# EAGLE design stm32teensy (EAGLE 9.6.2)
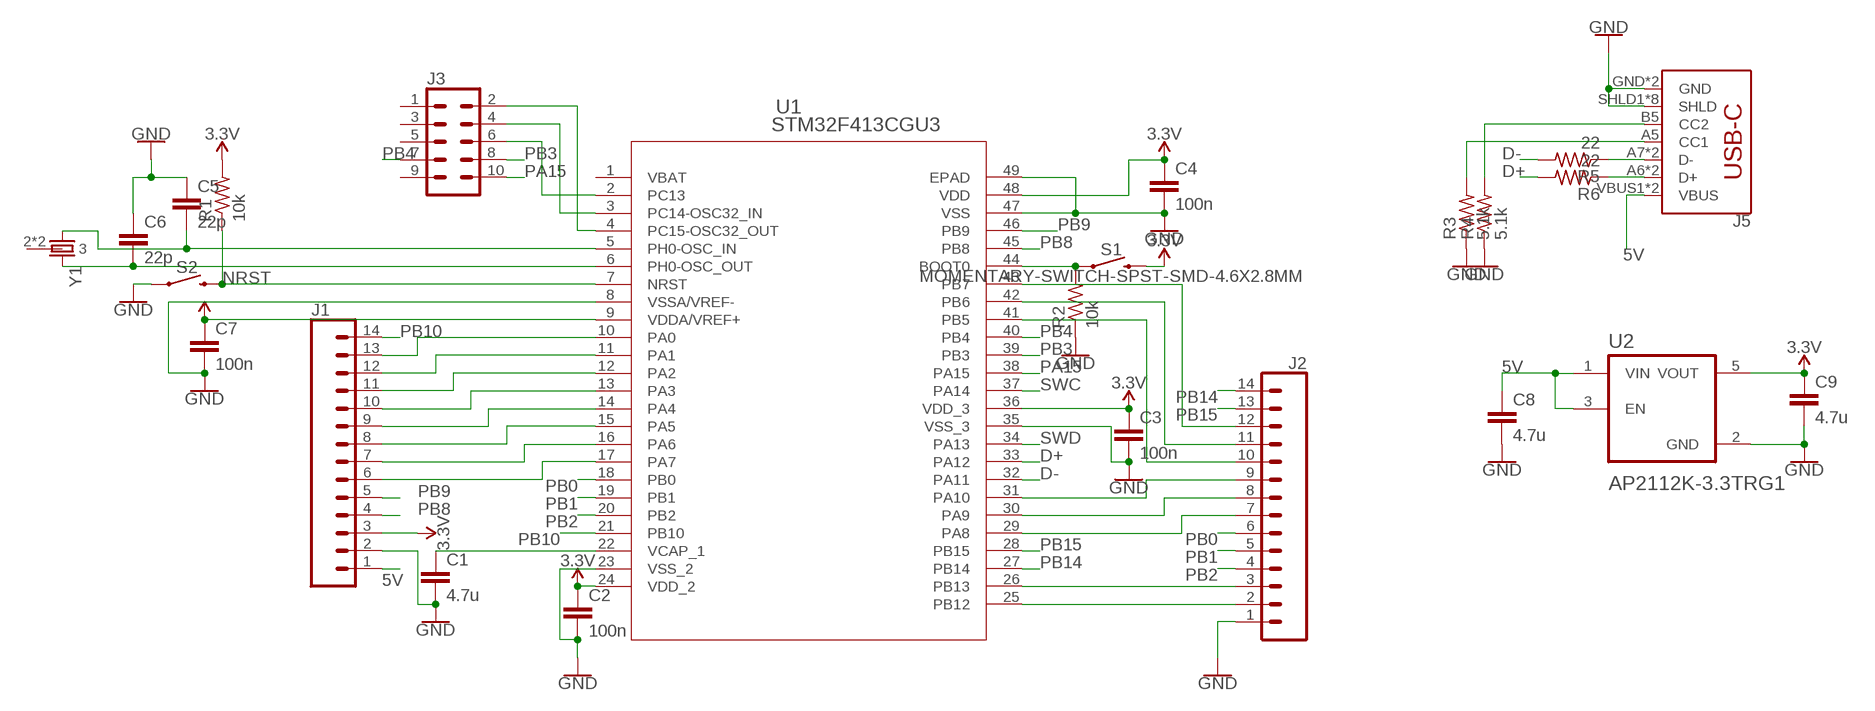
[diagram p0: schematic, sheet 1]

## Parts
C1  4.7u  C0402  [0402-C]
C2  100n  C0402  [0402-C]
C3  100n  C0402  [0402-C]
C4  100n  C0402  [0402-C]
C5  22p  C0402  [0402-C]
C6  22p  C0402  [0402-C]
C7  100n  C0402  [0402-C]
C8  4.7u  C0402  [0402-C]
C9  4.7u  C0402  [0402-C]
J1  CONN_14  [1X14]
J2  CONN_14  [1X14]
J3  CONN_05X2SHD_SMD  [2X5-SHROUDED_SMD]
J5  SPARKFUN-CONNECTORS_USB_C16PIN  [SPARKFUN-CONNECTORS_USB-C-16P]
R1  10k  R0402  [0402-R]
R2  10k  R0402  [0402-R]
R3  5.1k  R0402  [0402-R]
R4  5.1k  R0402  [0402-R]
R5  22  R0402  [0402-R]
R6  22  R0402  [0402-R]
S1  MOMENTARY-SWITCH-SPST-SMD-4.6X2.8MM  [TACTILE_SWITCH_SMD_4.6X2.8MM]
S2  MOMENTARY-SWITCH-SPST-SMD-4.6X2.8MM  [TACTILE_SWITCH_SMD_4.6X2.8MM]
U1  STM32F413CGU3  [UFQFPN_13CGU3_STM]
U2  AP2112K-3.3TRG1  [SOT95P285X140-5N]
Y1  CRYSTAL-3.2X2.54-PIN  [XTAL-3.2X2.5]

## Nets
3.3V: C2.1 C3.1 C4.1 C7.1 C9.1 J1.3 R1.2 S1.3 S1.4 U1.9(VDDA/VREF+) U1.24(VDD_2) U1.36(VDD_3) U1.48(VDD) U2.5(VOUT)
5V: C8.1 J1.1 J5.VBUS1(VBUS) J5.VBUS2(VBUS) U2.1(VIN) U2.3(EN)
D+: R6.2 U1.33(PA12)
D-: R5.2 U1.32(PA11)
GND: C1.2 C2.2 C3.2 C4.2 C5.1 C6.1 C7.2 C8.2 C9.2 J1.2 J2.1 J5.GND J5.GND2(GND) J5.SHLD1(SHLD) J5.SHLD2(SHLD) J5.SHLD3(SHLD) J5.SHLD4(SHLD) J5.SHLD5(SHLD) J5.SHLD6(SHLD) J5.SHLD7(SHLD) J5.SHLD8(SHLD) R2.1 R3.1 R4.1 S2.1 S2.2 U1.8(VSSA/VREF-) U1.23(VSS_2) U1.35(VSS_3) U1.47(VSS) U1.49(EPAD) U2.2(GND)
N$1: J3.6 U1.2(PC13)
N$2: R2.2 S1.1 S1.2 U1.44(BOOT0)
N$3: C6.2 U1.6(PH0-OSC_OUT) Y1.3
N$4: C5.2 U1.5(PH0-OSC_IN) Y1.1
N$5: J1.13 U1.10(PA0)
N$6: J2.10 U1.41(PB5)
N$7: C1.1 U1.22(VCAP_1)
N$8: J1.12 U1.11(PA1)
N$9: J1.11 U1.12(PA2)
N$10: J1.10 U1.13(PA3)
N$11: J1.9 U1.14(PA4)
N$12: J1.8 U1.15(PA5)
N$13: J1.7 U1.16(PA6)
N$14: J1.6 U1.17(PA7)
N$15: J2.2 U1.25(PB12)
N$16: J2.3 U1.26(PB13)
N$17: J2.11 U1.42(PB6)
N$18: J2.12 U1.43(PB7)
N$19: J2.7 U1.29(PA8)
N$20: J2.8 U1.30(PA9)
N$21: J2.9 U1.31(PA10)
N$22: J3.4 U1.3(PC14-OSC32_IN)
N$23: J3.2 U1.4(PC15-OSC32_OUT)
N$24: J5.A7(D-) J5.B7(D-) R5.1
N$25: J5.A6(D+) J5.B6(D+) R6.1
N$27: J5.A5(CC1) R3.2
N$28: J5.B5(CC2) R4.2
NRST: R1.1 S2.3 S2.4 U1.7(NRST)
PA15: J3.10 U1.38(PA15)
PB0: J2.6 U1.18(PB0)
PB1: J2.5 U1.19(PB1)
PB2: J2.4 U1.20(PB2)
PB3: J3.8 U1.39(PB3)
PB4: J3.7 U1.40(PB4)
PB8: J1.4 U1.45(PB8)
PB9: J1.5 U1.46(PB9)
PB10: J1.14 U1.21(PB10)
PB14: J2.14 U1.27(PB14)
PB15: J2.13 U1.28(PB15)
SWC: U1.37(PA14)
SWD: U1.34(PA13)
Unconnected: J3.1 J3.3 J3.5 J3.9 U1.1(VBAT) Y1.2 Y1.4

## Library data of the parts
C1-C9 = comma.ai:C
J1 J2 = SparkFun-Connectors:CONN_14: Multi connection point. Often used as Generic Header-pin footprint for 0.1 inch spaced/style header connections On any of the 0.1 inch spaced packages, you can populate with these: Break Away Headers - Straight <https://www.sparkfun.com/products/116> (PRT-00116) Break Away Male Headers - Right Angle <https://www.sparkfun.com/products/553> (PRT-00553) Female Headers <https://www.sparkfun.com/products/115> (PRT-00115) Break Away Headers - Machine Pin <https://www.sparkfun.com/products/117> (PRT-00117) Break Away Female Headers - Swiss Machine Pin <https://www.sparkfun.com/products/743> (PRT-00743) For SCREWTERMINALS and SPRING TERMINALS visit here: Screw Terimnals on SparkFun.com <https://www.sparkfun.com/search/results?term=Screw+Terminals> (5mm/3.5mm/2.54mm spacing) This device is also useful as a general connection point to wire up your design to another part of your project. Our various solder wires solder well into these plated through hole pads. Hook-Up Wire - Assortment (Stranded, 22 AWG) <https://www.sparkfun.com/products/11375> (PRT-11375) Hook-Up Wire - Assortment (Solid Core, 22 AWG) <https://www.sparkfun.com/products/11367> (PRT-11367) View the entire wire category on our website here <https://www.sparkfun.com/categories/141> Special notes: Molex polarized connector foot print use with SKU : PRT-08231 with associated crimp pins and housings. 1MM SMD Version SKU: PRT-10208 NOTES ON THE VARIANTS LOCK and LOCK_LONGPADS... This footprint was designed to help hold the alignment of a through-hole component (i.e. 6-pin header) while soldering it into place. You may notice that each hole has been shifted either up or down by 0.005 of an inch from it's more standard position (which is a perfectly straight line). This slight alteration caused the pins (the squares in the middle) to touch the edges of the holes. Because they are alternating, it causes a "brace" to hold the component in place. 0.005 has proven to be the perfect amount of "off-center" position when using our standard breakaway headers. Although looks a little odd when you look at the bare footprint, once you have a header in there, the alteration is very hard to notice. Also,if you push a header all the way into place, it is covered up entirely on the bottom side.
J3 = SparkFun-Connectors:CONN_05X2: Multi connection point. Often used as Generic Header-pin footprint for 0.1 inch spaced/style header connections For AVR SPI programming port, see special device with nice symbol: "AVR_SPI_PROG_5x2.dev" You can populate with any combo of single row headers, but if you'd like an exact match, check these: 2x5 AVR ICSP Male Header <https://www.sparkfun.com/products/778> (PRT-00778) 2x5 Pin Shrouded Header <https://www.sparkfun.com/products/8506> (PRT-08506) On any of the 0.1 inch spaced packages, you can populate with these: Break Away Headers - Straight <https://www.sparkfun.com/products/116> (PRT-00116) Break Away Male Headers - Right Angle <https://www.sparkfun.com/products/553> (PRT-00553) Female Headers <https://www.sparkfun.com/products/115> (PRT-00115) Break Away Headers - Machine Pin <https://www.sparkfun.com/products/117> (PRT-00117) Break Away Female Headers - Swiss Machine Pin <https://www.sparkfun.com/products/743> (PRT-00743) Special note: the shrouded connector mates well with our 5x2 ribbon cables: 2x5 Pin IDC Ribbon Cable <https://www.sparkfun.com/products/8535> (PRT-08535); PROD_ID: CONN-09508
J5 = USB-C-Breakout:SPARKFUN-CONNECTORS_USB_C: USB Type C 16Pin Connector Super Speed pins not available on the 16-pin purely SMD connector so this part is best for USB 2.0 implementations. D1 and D2 are tied together enabling D+/- no matter which way the cable is plugged into the connector. The two channel configuration pins (CC1/2) are exposed. These are normally connected to ground via 5.1k resistors but can be reconfigured for high current/high power applications.; PROD_ID: CONN-14122
R1-R6 = comma.ai:R
S1 S2 = SparkFun-Switches:MOMENTARY-SWITCH-SPST: Momentary Switch (Pushbutton) - SPST Normally-open (NO) SPST momentary switches (buttons, pushbuttons). Variants PTH-12MM - 12mm square, through-hole Momentary Pushbutton Switch - 12mm Square <https://www.sparkfun.com/products/9190> (COM-09190) PTH-6.0MM, PTH-6.0MM-KIT - 6.0mm square, through-hole Mini Pushbutton Switch <https://www.sparkfun.com/products/97> (COM-00097) KIT package intended for soldering kit's - only one side of pads' copper is exposed. PTH-RIGHT-ANGLE-KIT - Right-angle, through-hole Right Angle Tactile Button <https://www.sparkfun.com/products/10791> - Used on SparkFun BigTime Watch Kit <https://www.sparkfun.com/products/11734> SMD-12MM - 12mm square, surface-mount Tactile Button - SMD (12mm) <https://www.sparkfun.com/products/12993> (COM-12993) Used on SparkFun PicoBoard <https://www.sparkfun.com/products/11888> SMD-4.5MM - 4.5mm Square Trackball Switch Used on SparkFun Blackberry Trackballer Breakout <https://www.sparkfun.com/products/13169> SMD-4.6MMX2.8MM - 4.60mm x 2.80mm, surface mount Used on SparkFun SAMD21 Mini Breakout <https://www.sparkfun.com/products/13664> SMD-5.2MM, SMD-5.2-REDUNDANT - 5.2mm square, surface-mount Mini Pushbutton Switch - SMD <https://www.sparkfun.com/products/8720> (COM-08720) Used on Arduino Pro Mini <https://www.sparkfun.com/products/11114> REDUNDANT package connects both switch circuits together SMD-6.0X3.5MM - 6.0 x 3.5mm, surface mount Momentary Reset Switch SMD <https://www.sparkfun.com/products/8229> (COM-08229) SMD-6.2MM-TALL - 6.2mm square, surface mount Tactile Button - SMD (6mm) <https://www.sparkfun.com/products/12992> Used on SparkFun Digital Sandbox <https://www.sparkfun.com/products/12651> SMD-RIGHT-ANGLE - Right-angle, surface mount Used on SparkFun Block for Intel® Edison - Arduino <https://www.sparkfun.com/products/13036>; PROD_ID: SWCH-13065
U1 = STMicroelectronics - STM32F303CCT6:STM32F413CGU3; BUILT_BY: EMA_Matt; COPYRIGHT: Copyright (C) 2018 Accelerated Designs. All rights reserved; DATASHEET: https://www.st.com/resource/en/datasheet/stm32f413cg.pdf; MANUFACTURER_PART_NUMBER: STM32F413CGU3; SOURCELIBRARY: Add_to_database_2020-11-25; VENDOR: STMicroelectronics
U2 = AP2112K-3.3TRG1:AP2112K-3.3TRG1: AP2112 Series 0.6 A 3.3 V Fixed Output SMT LDO Linear Regulator - SOT23-5 Check prices <https://pricing.snapeda.com/parts/AP2112K-3.3TRG1/Diodes%20Inc./view-part?ref=eda>; AVAILABILITY: Good; DESCRIPTION: Linear Voltage Regulator IC 1 Output 600mA SOT-25; MF: Diodes Inc.; MP: AP2112K-3.3TRG1; PACKAGE: SOT-753 Diodes Inc.; PRICE: None; PURCHASE-URL: https://pricing.snapeda.com/search/part/AP2112K-3.3TRG1/?ref=eda
Y1 = comma.ai:CRYSTAL-3.2X2.5

## Board
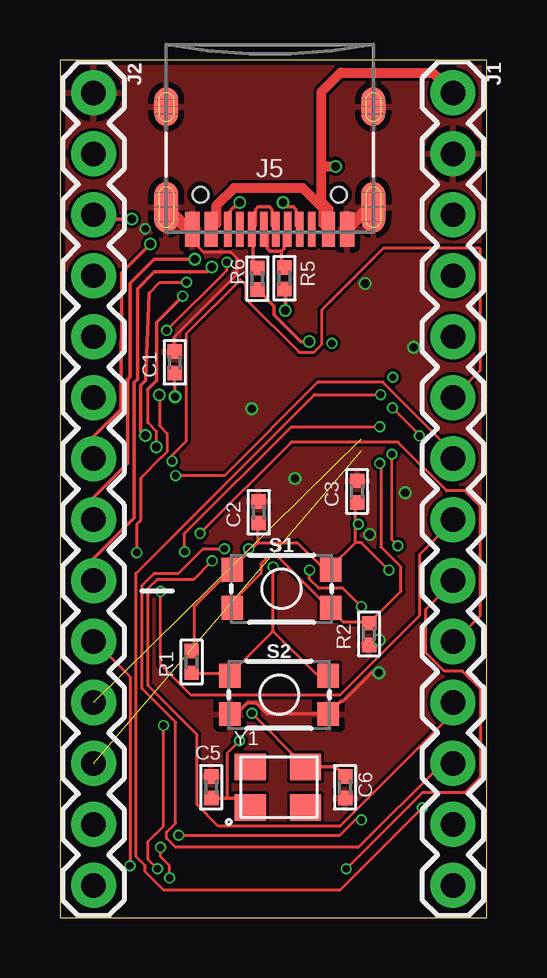
[diagram p1: board, top side]
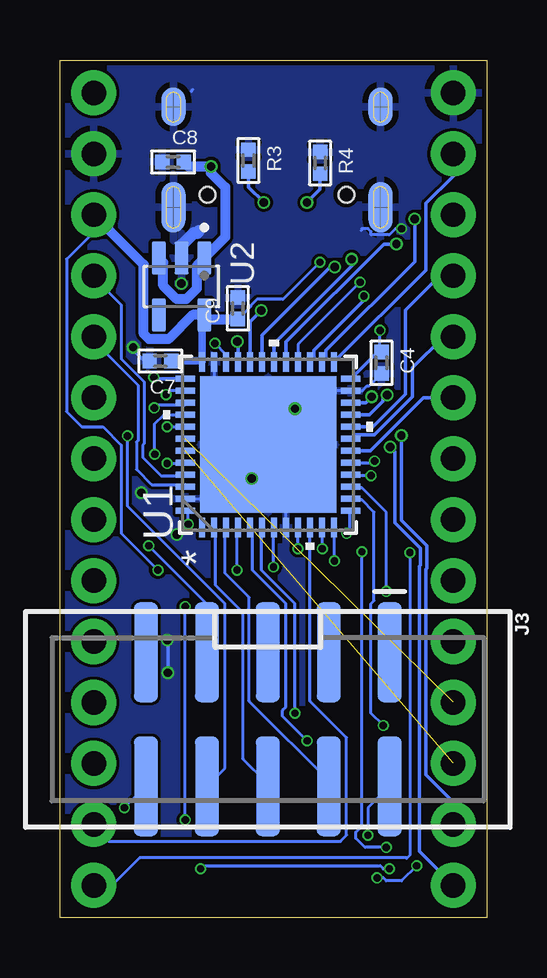
[diagram p2: board, bottom side, seen from below]

Size 17.8 x 35.73 mm. Coordinates in mm from the lower left corner, seen from the top.
Outline: 0,0 17.8,0 17.8,35.73 0,35.73 0,0
Copper layers (1*16): Top 0.035559375mm / dielectric 1.6mm / Bottom 0.035559375mm
Design rules "jlcpcb2layer": minimum track width 5mil, minimum drill 12mil, track to track 5mil, track to pad 5mil, pad to pad 5mil, via to via 5mil, smd to smd 5mil, copper to edge 8mil, drill to drill 6mil, minimum pad ring 5mil, minimum via ring 3mil, stop-mask expansion 2.5mil, vias tented up to drill 0mil, thermal gap 10mil

### Footprints (pad centres in the part's own frame; a part is rotated, then mirrored left to right if it is on the bottom)
0402-C = smd 0.6 x 0.6: 1 -0.45,0; 2 0.45,0
1X14 = drill 1.016 pad 1.88: 1 0,0; 2 2.54,0; 3 5.08,0; 4 7.62,0; 5 10.16,0; 6 12.7,0; 7 15.24,0; 8 17.78,0; 9 20.32,0; 10 22.86,0; 11 25.4,0; 12 27.94,0; 13 30.48,0; 14 33.02,0
2X5-SHROUDED_SMD = smd 4.15 x 1: 1 -2.794,5.08; 2 2.794,5.08; 3 -2.794,2.54; 4 2.794,2.54; 5 -2.794,0; 6 2.794,0; 7 -2.794,-2.54; 8 2.794,-2.54; 9 -2.794,-5.08; 10 2.794,-5.08
SPARKFUN-CONNECTORS_USB-C-16P = smd 0.3 x 1.45: A5 -1.25,0; A6 -0.25,0; A7 0.25,0; A8 1.25,0; B5 1.75,0; B6 0.75,0; B7 -0.75,0; B8 -1.75,0 | smd 0.6 x 1.45: GND -3.225,0; GND2 3.225,0 | smd 1 x 2.1: SHLD1 -4.32,-0.915; SHLD2 4.32,-0.915 | smd 1 x 2.1 bottom: SHLD3 -4.32,-0.915; SHLD4 4.32,-0.915 | smd 1 x 1.6: SHLD5 -4.32,-5.095; SHLD8 4.32,-5.095 | smd 1 x 1.6 bottom: SHLD6 -4.32,-5.095; SHLD7 4.32,-5.095 | smd 0.55 x 1.45: VBUS1 -2.45,0; VBUS2 2.45,0 | hole 0.65: -2.89,-1.445; 2.89,-1.445
0402-R = smd 0.6 x 0.6: 1 -0.45,0; 2 0.45,0
TACTILE_SWITCH_SMD_4.6X2.8MM = smd 0.9 x 1: 1 -2.05,-0.8; 2 2.05,-0.8; 3 2.05,0.8; 4 -2.05,0.8
UFQFPN_13CGU3_STM = smd 0.808 x 0.255: 1 -3.452,2.751; 2 -3.452,2.251; 3 -3.452,1.75; 4 -3.452,1.25; 5 -3.452,0.75; 6 -3.452,0.25; 7 -3.452,-0.25; 8 -3.452,-0.75; 9 -3.452,-1.25; 10 -3.452,-1.75; 11 -3.452,-2.251; 12 -3.452,-2.751; 25 3.452,-2.751; 26 3.452,-2.251; 27 3.452,-1.75; 28 3.452,-1.25; 29 3.452,-0.75; 30 3.452,-0.25; 31 3.452,0.25; 32 3.452,0.75; 33 3.452,1.25; 34 3.452,1.75; 35 3.452,2.251; 36 3.452,2.751 | smd 0.255 x 0.808: 13 -2.751,-3.452; 14 -2.251,-3.452; 15 -1.75,-3.452; 16 -1.25,-3.452; 17 -0.75,-3.452; 18 -0.25,-3.452; 19 0.25,-3.452; 20 0.75,-3.452; 21 1.25,-3.452; 22 1.75,-3.452; 23 2.251,-3.452; 24 2.751,-3.452; 37 2.751,3.452; 38 2.251,3.452; 39 1.75,3.452; 40 1.25,3.452; 41 0.75,3.452; 42 0.25,3.452; 43 -0.25,3.452; 44 -0.75,3.452; 45 -1.25,3.452; 46 -1.75,3.452; 47 -2.251,3.452; 48 -2.751,3.452 | smd 5.69 x 5.69: 49 0,0
SOT95P285X140-5N = smd 1.35 x 0.6: 1 -1.185,0.95; 2 -1.185,0; 3 -1.185,-0.95; 4 1.185,-0.95; 5 1.185,0.95
XTAL-3.2X2.5 = smd 1.3 x 1.1: 1 0,-1.8; 2 2.3,-1.8; 3 2.3,-0.1; 4 0,-0.1

### Placement (x,y rotation side)
C1  4.79,23.13 90 top
C2  8.29,16.89 90 top
C3  12.39,17.75 90 top
C4  4.39,23.11 270 bottom
C5  6.31,5.43 270 top
C6  11.89,5.43 90 top
C7  13.61,23.19 180 bottom
C8  13.08,31.48 180 bottom
C9  10.38,25.38 90 bottom
J1  16.39,34.36 270 top
J2  1.4,34.36 270 top
J3  9.13,8.26 270 bottom
J5  8.75,28.68 180 top
R1  5.49,10.65 90 top
R2  12.89,11.81 90 top
R3  9.94,31.54 270 bottom
R4  6.95,31.44 270 bottom
R5  9.36,26.64 270 top
R6  8.23,26.62 270 top
S1  9.24,13.7 0 top
S2  9.14,9.28 0 top
U1  9.12,19.7 90 bottom
U2  12.73,26.29 270 bottom
Y1  7.94,6.38 0 top

### Tracks (layer width: path | path; a pad name or v marks a point on that pad's centre or on a via)
3.3V  (via drill 0.3)
  Top 0.127: v4.45,24.46 6.96,26.97 v6.96,27.3 | 12.32,15.62 12.32,16.38 | 12.32,16.38 12.32,17.27 C3.1 | 12.32,15.62 11.3,14.61 S1.3 11.18,14.61 10.92,14.61 9.91,15.62 8.26,15.62 | 12.32,16.38 v12.45,16.38 | R1.2 5.59,11.18 5.59,12.95 7.11,14.48 S1.4 7.24,14.61 8,15.37 | 8.26,15.62 8.26,16.38 C2.1 | 8,15.37 8.26,15.62 | 8,15.37 v7.87,15.37 | 12.32,15.62 12.57,15.62 v13.72,14.48
  Bottom 0.127: C4.1 4.45,23.62 v4.45,24.46 | v6.96,27.3 8.51,25.75 9.59,25.75 9.85,25.49 9.85,25.46 C9.1 | v12.45,16.38 12.45,16.89 U1.48 | v7.87,15.37 7.87,16.13 U1.9 | v13.72,14.48 15.24,16 15.24,19.68 16,20.45 16.89,20.45 17.53,21.08 17.53,27.43 16.13,28.83 J1.3
  Bottom 0.15: U1.24 4.56,23.56 C4.1
  Bottom 0.305: U2.5 11.87,25.01 U1.36 11.91,23.19 C7.1
  Bottom 0.406: C9.1 11.61,24.93 U2.5 12.26,25.11 13.27,24.1 14.09,24.1 14.31,24.32 14.31,27.2 J1.3
5V  (via drill 0.35)
  Top 0.406: J5.VBUS2 6.52,28.9 6.52,29.65 7.25,30.39 10.13,30.39 10.98,29.54 10.98,28.9 J5.VBUS1 11.2,29.53 10.91,29.82 10.91,31.3 | 10.91,31.3 10.91,34.41 11.7,35.2 15.55,35.2 J1.1 | 10.91,31.3 v11.5,31.3
  Bottom 0.406: U2.3 13.49,27.29 13.49,26.33 12.93,25.77 12.53,25.77 12.1,26.2 12.1,27.16 U2.1 10.91,28.35 10.91,30.43 11.5,31.02 v11.5,31.3 12.45,31.3 C8.1
D+  (via drill 0.35)
  Top 0.15: R6.2 8.94,25.46 8.94,25.11 10.04,24 v10.4,24
  Bottom 0.15: U1.33 10.37,23.97 v10.4,24
D-  (via drill 0.35)
  Top 0.15: v9.4,25.3 9.4,26.15 R5.2
  Bottom 0.15: U1.32 9.87,24.83 v9.4,25.3
GND  (via drill 0.3, 0.35)
  Top 0.127: C1.2 4.79,24.21 7.38,26.8 7.38,27.47 7.13,27.72 5.99,27.72 5.53,28.19 J5.GND2
  Top 0.152: S2.1 7.36,8.48 7.82,8.94 8.18,8.94 8.64,8.48 S2.2 11.71,9 11.79,9 12.99,10.2 v13.3,10.2 | v13.32,11.57 13.11,11.36 R2.1
  Top 0.508: J5.GND2 5.34,28.68 J5.SHLD2 | J5.GND 12.89,29.59 J5.SHLD1
  Bottom 0.127: C4.2 4.9,22.15 4.99,22.15 5.19,21.95 U1.23 6.87,21.95 U1.49 | U1.35 11.37,21.95 9.16,19.74 | 9.16,19.74 U1.49 | U1.8 8.37,18.95 U1.49 | U1.47 11.45,17.45 9.16,19.74 | 12.32,34.42 12.27,34.5 | v3.56,28.7 3.81,28.7 4.06,28.45 4.83,28.45 4.83,28.57 4.95,28.7 5.21,28.7 5.23,28.62
  Bottom 0.152: v13.3,10.2 13.3,11.55 v13.32,11.57 | U1.49 8,20.82 v8,21.2 | v14.75,23.76 14.75,23.65 14.29,23.19 C7.2
  Bottom 0.508: 12,28.6 12.07,28.53 12.21,28.53 12.73,28.01 U2.2
  other vias: 9.8,18.3 12.73,26.41 14.4,17.7 12.92,15.96
  pour Top: 0,35.8 17.8,35.8 17.8,0 0,0
  pour Bottom: 0,35.7 17.8,35.7 17.8,0 0,0
N$1
  Bottom 0.127: U1.2 11.3,16.13 11.3,13.84 10.16,12.7 10.16,6.6 9.14,5.59 J3.6
N$2  (via drill 0.3)
  Top 0.127: v13.34,18.92 13.38,18.87 13.38,15.44 14.22,14.61 14.22,13.59 12.95,12.32 R2.2 12.83,12.32 11.81,12.32 11.3,12.83 S1.2 11.18,12.95 9.02,15.11 8.76,15.11 8.38,14.73 8.38,14.35 7.24,13.21 7.24,12.95 S1.1
  Bottom 0.127: v13.34,18.92 12.57,18.92 U1.44
N$3  (via drill 0.3)
  Top 0.127: v8,8.51 10.16,6.35 Y1.3
  Top 0.15: Y1.3 11.49,6.28 C6.2
  Bottom 0.127: v8,8.51 8,13.08 9.4,14.48 9.4,16.13 U1.6
N$4  (via drill 0.3)
  Top 0.127: v7.49,7.37 6.99,6.86 6.99,4.98
  Top 0.15: C5.2 6.99,4.98 7.54,4.98 Y1.1
  Bottom 0.127: v7.49,7.37 8.51,8.38 8.51,8.64 8.38,8.76 8.38,13.08 9.78,14.48 9.78,16.13 U1.5
N$5
  Bottom 0.127: U1.10 7.37,16.13 7.37,9.02 5.84,7.49 5.84,3.43 6.1,3.17 15.75,3.17 16.38,3.81 J1.13
N$6  (via drill 0.3)
  Top 0.127: v13.34,20.45 9.65,20.45 5.21,16 v5.21,15.24 | v4.19,2.92 4.19,2.54 4.57,2.16 v4.57,1.65 | v2.92,2.16 2.92,10.03 1.52,11.43 J2.10
  Bottom 0.127: v13.34,20.45 U1.41 | v5.21,15.24 5.21,3.81 5.46,3.56 5.46,3.3 5.08,2.92 v4.19,2.92 | v4.57,1.65 4.32,1.65 4.19,1.52 3.56,1.52 v2.92,2.16
N$7  (via drill 0.35)
  Top 0.127: v4.8,21.7 4.8,21.93 C1.1
  Bottom 0.15: U1.22 5.05,21.45 v4.8,21.7
N$8  (via drill 0.3)
  Top 0.127: v6.86,15.37 5.97,15.37 4.95,14.35 3.94,14.35 3.43,13.84 3.43,9.53 4.83,8.13 4.83,3.94 4.45,3.56 4.45,3.3 4.83,2.92 12.45,2.92 15.88,6.35 16.38,6.35 J1.12
  Bottom 0.127: v6.86,15.37 6.86,16.13 U1.11
N$9  (via drill 0.3)
  Top 0.127: v6.35,14.86 5.59,14.1 4.06,14.1 3.68,13.72 3.68,9.65 5.71,7.62 5.71,4.7 6.6,3.81 11.68,3.81 16.38,8.51 16.38,8.89 J1.11
  Bottom 0.127: v6.35,14.86 6.35,16.13 U1.12
N$10  (via drill 0.3)
  Top 0.127: v5.84,16 9.65,19.81 14.1,19.81 16.13,17.78 16.89,17.78 17.53,17.14 17.53,12.57 16.51,11.56 J1.10
  Bottom 0.127: v5.84,16 5.71,16.13 5.71,16.89 U1.13
N$11  (via drill 0.3)
  Top 0.127: v4.32,8 4.32,3.81 3.68,3.17 3.68,2.41 v4.06,2.03 | v11.94,2.03 15.11,5.21 16.89,5.21 17.53,5.84 17.53,9.53 16.76,10.29 16,10.29 15.24,11.05 15.24,12.83 16.38,13.97 J1.9
  Bottom 0.127: v4.32,8 4.83,8.51 4.83,13.08 4.7,13.21 4.7,16.89 5.21,17.4 5.59,17.4 U1.14 | v4.06,2.03 4.32,2.03 4.45,2.16 11.81,2.16 v11.94,2.03
N$12  (via drill 0.3)
  Top 0.127: v4.19,13.59 4.19,10.54 5.46,9.27 11.68,9.27 14.99,12.57 14.99,15.11 16.38,16.51 J1.8
  Bottom 0.127: v4.19,13.59 4.19,16.89 5.21,17.91 5.59,17.91 U1.15
N$13  (via drill 0.3)
  Top 0.127: v4.83,18.41 6.86,18.41 10.75,22.31 13.47,22.31 16.38,19.39 16.38,19.18 J1.7
  Bottom 0.127: v4.83,18.41 5.59,18.41 U1.16
N$14  (via drill 0.3)
  Top 0.127: v4.68,19.02 4.68,19.25 5.28,19.86 5.28,24.34 7.52,26.58 7.74,26.36 7.74,25.79 9.98,23.55 10.59,23.55 10.92,23.88 10.92,25.32 13.5,27.9 17.5,27.9 17.5,27.23 17.52,27.21 17.52,22.79 J1.6
  Bottom 0.127: U1.17 4.75,18.95 v4.68,19.02
N$15
  Bottom 0.15: U1.25 2.54,26.98 2.54,29.75 1.4,30.89 J2.2
N$16  (via drill 0.35)
  Top 0.15: v3.01,29.1 1.58,29.1 J2.3
  Bottom 0.15: U1.26 6.7,23.32 6.7,23.64 3.01,27.33 v3.01,29.1
N$17  (1 unrouted)
N$18  (1 unrouted)
N$19  (via drill 0.35)
  Top 0.15: v3.77,28.06 2.57,26.86 2.57,24.07 2.54,24.04 2.54,21.19 1.4,20.05 J2.7
  Bottom 0.15: U1.29 8.37,23.99 4.3,28.06 v3.77,28.06
N$20  (via drill 0.35)
  Top 0.15: v5.63,27.43 3.93,27.43 2.93,26.43 2.93,22.53 2.82,22.42 2.82,18.92 1.4,17.5 J2.8
  Bottom 0.15: U1.30 8.87,23.91 5.63,27.15 v5.63,27.43
N$21  (via drill 0.35)
  Top 0.15: v6.33,27.1 6.13,26.9 3.93,26.9 3.23,26.2 3.23,22.43 3.1,22.3 3.1,16.66 1.4,14.96 J2.9
  Bottom 0.15: U1.31 9.37,24.26 6.53,27.1 v6.33,27.1
N$22
  Bottom 0.127: U1.3 10.92,16.13 10.92,14.35 9.91,13.34 9.91,9.02 6.48,5.59 J3.4
N$23  (via drill 0.3)
  Top 0.127: v10.41,14.48 10.41,14.1 10.79,13.72 11.81,13.72 v12.57,12.95 | v12.57,4.06 12.32,4.06 11.68,3.43 v4.95,3.43
  Bottom 0.127: v10.41,14.48 10.41,16.13 U1.4 | v12.57,4.06 v12.57,12.95 | v4.95,3.43 4.95,4.57 4.06,5.46 J3.2
N$24
  Top 0.152: 9.23,27.75 8.77,27.75 8.65,27.87 8.65,28.53 J5.A7 | 9.23,27.75 9.35,27.87 9.35,28.53 J5.B7 | R5.1 9.23,27.22 9.23,27.75
N$25
  Top 0.152: J5.A6 8.85,28.83 8.85,29.49 8.73,29.61 8.27,29.61 8.15,29.49 8.15,28.83 J5.B6 8,28.15 8.05,28.1 8.05,27.25 R6.1
N$27  (via drill 0.35)
  Top 0.152: J5.A5 9.85,28.83 9.85,29.49 9.73,29.61 9.49,29.61 v9.3,29.79
  Bottom 0.152: v9.3,29.79 9.94,30.43 R3.2
N$28  (via drill 0.35)
  Top 0.152: v7.5,29.79 7.31,29.61 7.27,29.61 7,29.34 J5.B5
  Bottom 0.152: v7.5,29.79 6.95,30.34 R4.2
NRST  (via drill 0.3)
  Top 0.127: R1.1 5.59,10.16 6.99,10.16 S2.4 7.11,10.16 8.89,11.94 | 8.89,11.94 v8.89,14.61 | 8.89,11.94 10.67,10.16 11.18,10.16 S2.3
  Bottom 0.127: v8.89,14.61 8.89,16.13 U1.7
PA15  (via drill 0.3)
  Top 0.127: v13.38,21.79 10.61,21.79 3.17,14.35 3.17,2.54 3.56,2.16 3.56,1.91 4.32,1.14 11.68,1.14 v15.11,4.57
  Bottom 0.127: v13.38,21.79 13.19,21.97 12.57,21.97 U1.38 | v15.11,4.57 14.22,5.46 J3.10
PB0
  Bottom 0.15: U1.18 4.85,19.45 2.64,21.66 J2.6
PB1
  Bottom 0.15: U1.19 5.5,20.12 4.69,20.12 3.1,21.71 3.1,22.9 1.8,24.2 J2.5
PB2
  Bottom 0.15: U1.20 4.75,20.45 3.4,21.8 3.4,25.3 1.96,26.74 J2.4
PB3  (via drill 0.3)
  Top 0.127: v14.99,20.07 14.99,20.12 v13.87,21.24
  Bottom 0.127: v13.87,21.24 13.74,21.37 12.58,21.37 12.58,21.44 U1.39 | v14.99,20.07 14.99,17.14 10.92,13.08 10.92,6.22 11.56,5.59 J3.8
PB4  (via drill 0.3)
  Top 0.127: v13.84,19.3 13.84,15.75 v14.1,15.49
  Bottom 0.127: v13.84,19.3 13.84,20.57 13.46,20.95 U1.40 | v14.1,15.49 11.68,13.08 11.68,11.18 J3.7
PB8
  Bottom 0.127: U1.45 12.57,18.41 13.59,18.41 14.35,19.18 14.35,19.68 14.29,19.74 14.29,22.33 15.24,23.27 15.24,25.53 16.38,26.67 J1.4
PB9
  Bottom 0.127: U1.46 12.57,18.03 13.97,18.03 14.61,18.67 14.61,19.81 14.55,19.87 14.55,22.18 16.37,24.01 J1.5
PB10  (via drill 0.3, 0.35)
  Top 0.127: v4.15,21.78 4.15,20.49 4.48,20.16 4.48,19.41 4.21,19.15 3.36,18.3 3.36,16.55 3.21,16.4 v3.21,15.21
  Bottom 0.127: v3.21,15.21 3.21,2.59 3.34,2.46 3.37,2.49 14.47,2.49 15.62,1.34 J1.14
  Bottom 0.15: v4.15,21.78 4.33,21.59 4.33,21.51 4.89,20.95 U1.21
PB14  (via drill 0.3, 0.35)
  Top 0.127: 3.65,22.01 3.65,20.63 4.01,20.27 4.01,19.61 v4.03,19.6
  Top 0.15: v5.12,25.89 4.02,24.8 4.02,22.38 3.65,22.01
  Bottom 0.15: J2.14 2.82,2.76 2.82,14.63 2.78,14.67 2.78,15.38 3.84,16.45 3.84,19.41 v4.03,19.6 | U1.27 7.2,23.32 7.2,23.64 5.12,25.72 v5.12,25.89
PB15  (via drill 0.3, 0.35)
  Top 0.127: 3.71,26.02 4.17,26.47 v5.28,26.47
  Top 0.15: 3.71,26.02 3.58,22.38 3.37,22.17 3.37,20.27 v3.56,20.08
  Bottom 0.127: v5.28,26.47 7.87,23.88 U1.28
  Bottom 0.15: v3.56,20.08 3.56,16.56 2.5,15.5 2.5,14.55 2.54,14.51 2.54,5.95 1.4,4.8 J2.13
SWC  (via drill 0.3)
  Bottom 0.15: U1.37 13.82,22.45 v13.89,22.51
SWD  (via drill 0.3)
  Bottom 0.127: U1.34 10.87,23.45 v11.34,23.92